# EAGLE schematic zed_io_board (EAGLE 6.5.0)
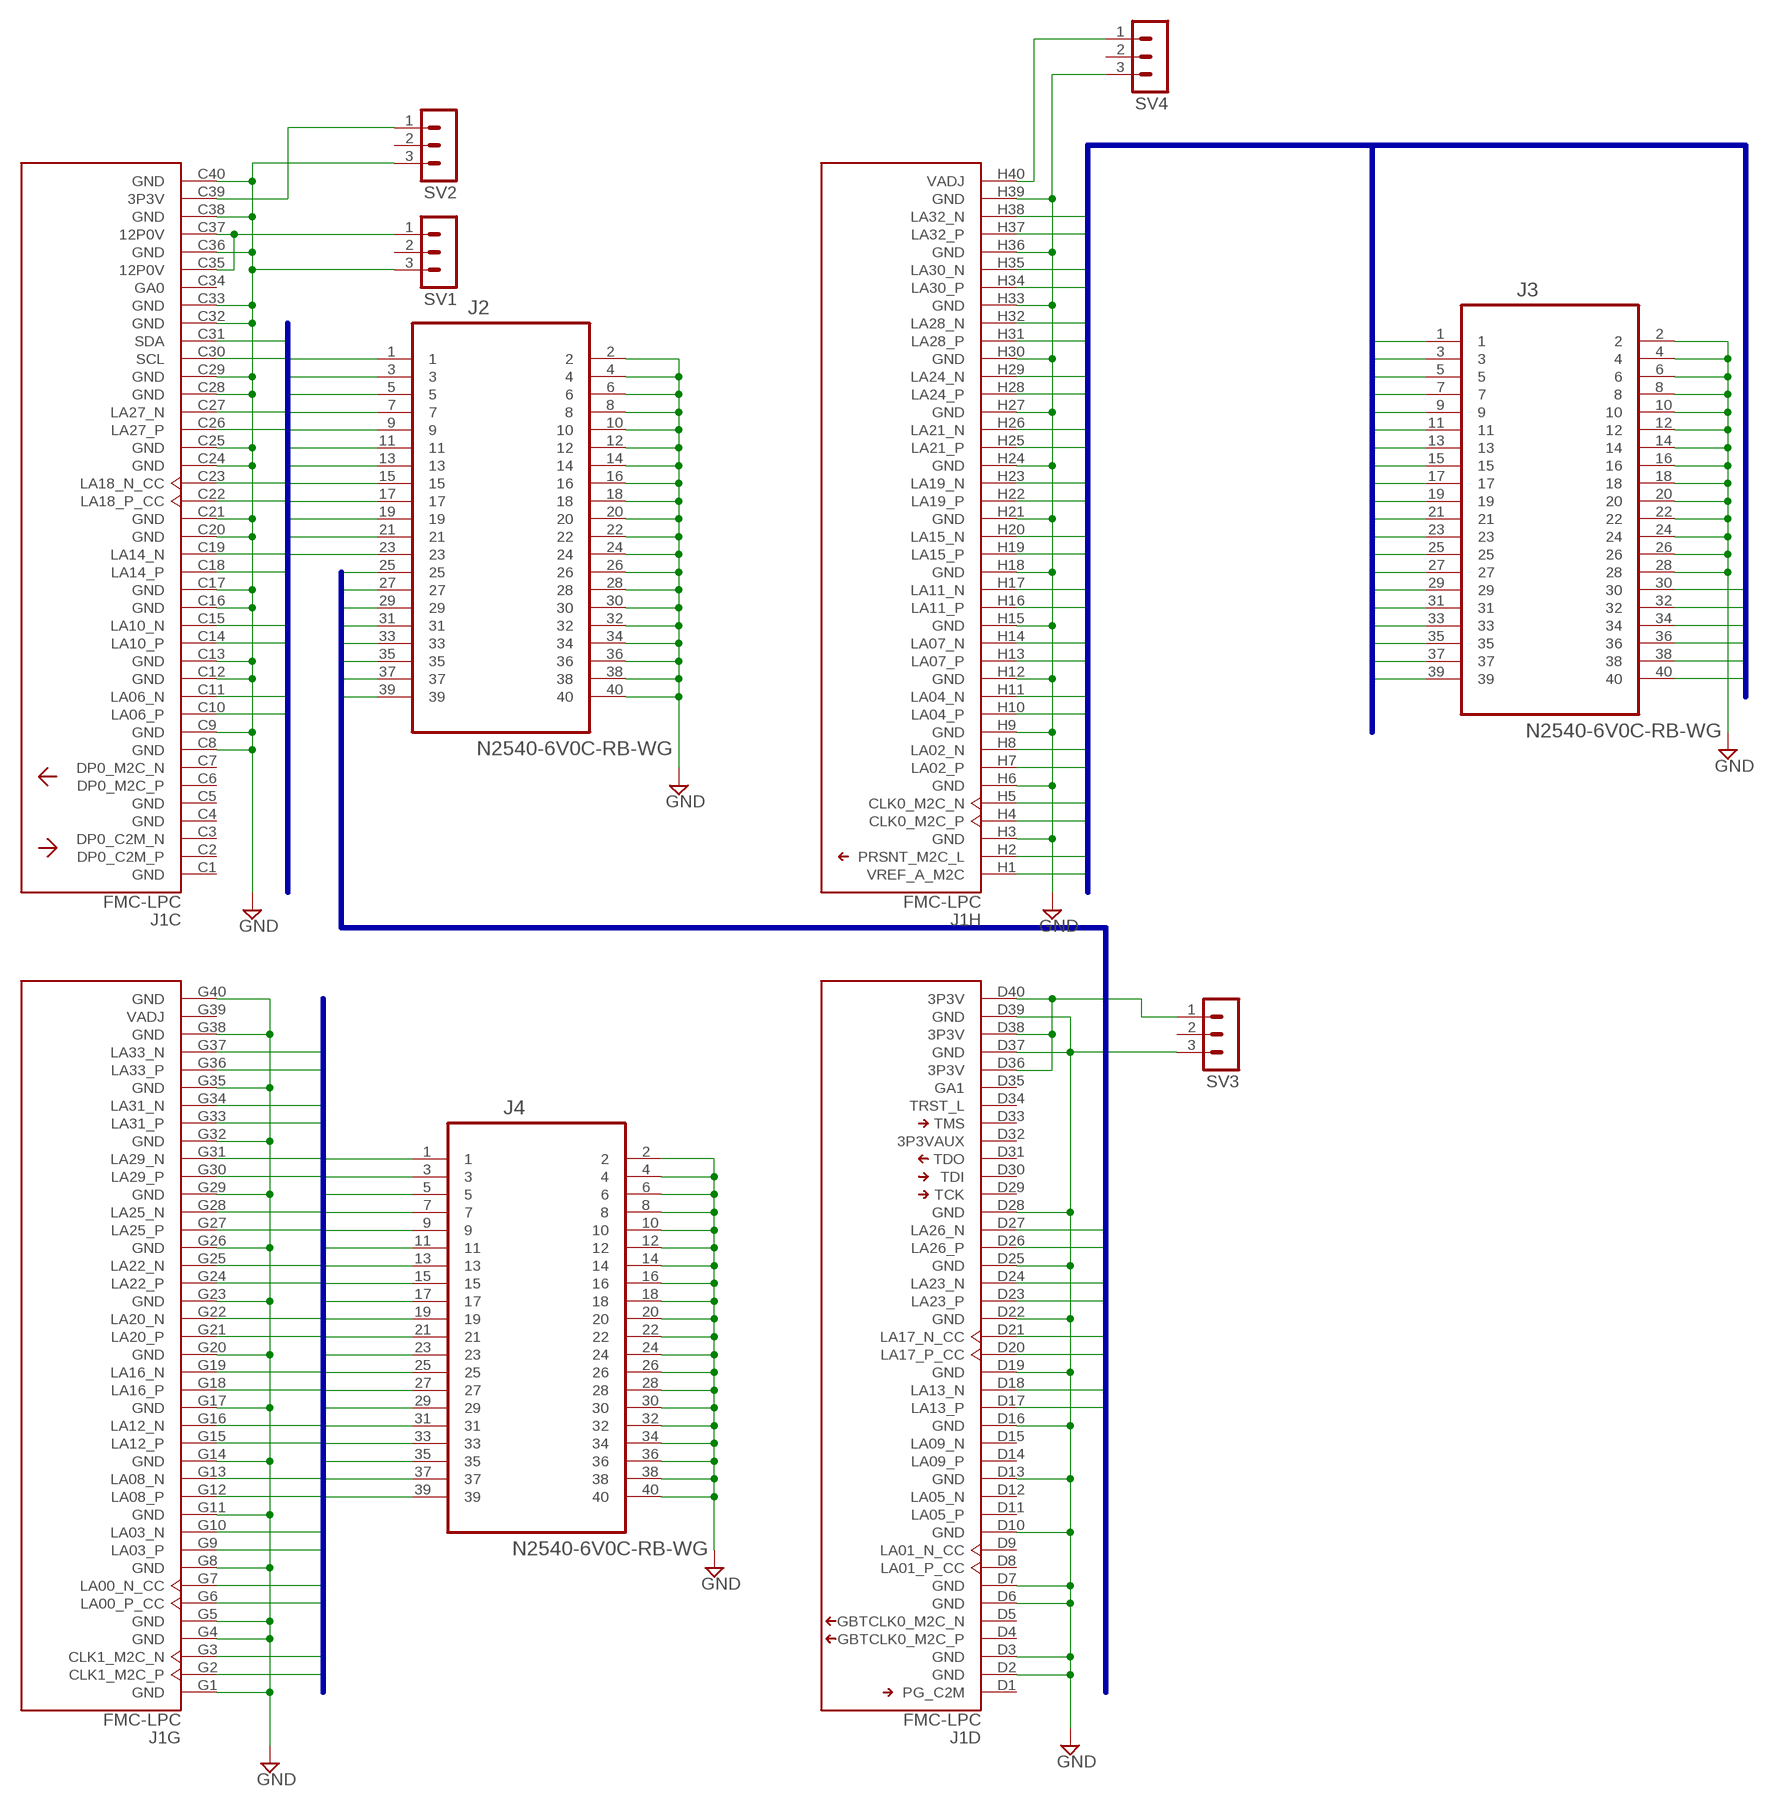
[diagram p0: schematic, sheet 1]

## Parts
J1  FMC-LPC  [FMC-LPC-MALE]
J2  N2540-6V0C-RB-WG  [N2540-6V0C-RB-WG]
J3  N2540-6V0C-RB-WG  [N2540-6V0C-RB-WG]
J4  N2540-6V0C-RB-WG  [N2540-6V0C-RB-WG]
SV1  MA03-1  [MA03-1]
SV2  MA03-1  [MA03-1]
SV3  MA03-1  [MA03-1]
SV4  MA03-1  [MA03-1]

## Nets
BA1: J1.H38(H:LA32_N) J3.1
BA2: J1.H37(H:LA32_P) J3.3
BA3: J1.H35(H:LA30_N) J3.5
BA4: J1.H34(H:LA30_P) J3.7
BA5: J1.H32(H:LA28_N) J3.9
BA6: J1.H31(H:LA28_P) J3.11
BA7: J1.H29(H:LA24_N) J3.13
BA8: J1.H28(H:LA24_P) J3.15
BA9: J1.H26(H:LA21_N) J3.17
BA10: J1.H25(H:LA21_P) J3.19
BA11: J1.H23(H:LA19_N) J3.21
BA12: J1.H22(H:LA19_P) J3.23
BA13: J1.H20(H:LA15_N) J3.25
BA14: J1.H19(H:LA15_P) J3.27
BA15: J1.H17(H:LA11_N) J3.29
BA16: J1.H16(H:LA11_P) J3.31
BA17: J1.H14(H:LA07_N) J3.33
BA18: J1.H13(H:LA07_P) J3.35
BA19: J1.H11(H:LA04_N) J3.37
BA20: J1.H10(H:LA04_P) J3.39
BA21: J1.H8(H:LA02_N) J3.30
BA22: J1.H7(H:LA02_P) J3.32
BA23: J1.H5(H:CLK0_M2C_N) J3.34
BA24: J1.H4(H:CLK0_M2C_P) J3.36
BA25: J1.H2(H:PRSNT_M2C_L) J3.38
BA26: J1.H1(H:VREF_A_M2C) J3.40
BB1: J1.C31(C:SDA) J2.1
BB2: J1.C30(C:SCL) J2.3
BB3: J1.C27(C:LA27_N) J2.5
BB4: J1.C26(C:LA27_P) J2.7
BB5: J1.C23(C:LA18_N_CC) J2.9
BB6: J1.C22(C:LA18_P_CC) J2.11
BB7: J1.C19(C:LA14_N) J2.13
BB8: J1.C18(C:LA14_P) J2.15
BB9: J1.C15(C:LA10_N) J2.17
BB10: J1.C14(C:LA10_P) J2.19
BB11: J1.C11(C:LA06_N) J2.21
BB12: J1.C10(C:LA06_P) J2.23
BD1: J1.D27(D:LA26_N) J2.25
BD2: J1.D26(D:LA26_P) J2.27
BD3: J1.D24(D:LA23_N) J2.29
BD4: J1.D23(D:LA23_P) J2.31
BD5: J1.D21(D:LA17_N_CC) J2.33
BD6: J1.D20(D:LA17_P_CC) J2.35
BD7: J1.D18(D:LA13_N) J2.37
BD8: J1.D17(D:LA13_P) J2.39
BG1: J1.G37(G:LA33_N) J4.1
BG2: J1.G36(G:LA33_P) J4.3
BG3: J1.G34(G:LA31_N) J4.5
BG4: J1.G33(G:LA31_P) J4.7
BG5: J1.G31(G:LA29_N) J4.9
BG6: J1.G30(G:LA29_P) J4.11
BG7: J1.G28(G:LA25_N) J4.13
BG8: J1.G27(G:LA25_P) J4.15
BG9: J1.G25(G:LA22_N) J4.17
BG10: J1.G24(G:LA22_P) J4.19
BG11: J1.G22(G:LA20_N) J4.21
BG12: J1.G21(G:LA20_P) J4.23
BG13: J1.G19(G:LA16_N) J4.25
BG14: J1.G18(G:LA16_P) J4.27
BG15: J1.G16(G:LA12_N) J4.29
BG16: J1.G15(G:LA12_P) J4.31
BG17: J1.G13(G:LA08_N) J4.33
BG18: J1.G12(G:LA08_P) J4.35
BG19: J1.G10(G:LA03_N) J4.37
BG20: J1.G9(G:LA03_P) J4.39
BG21: J1.G7(G:LA00_N_CC)
BG22: J1.G6(G:LA00_P_CC)
BG23: J1.G3(G:CLK1_M2C_N)
BG24: J1.G2(G:CLK1_M2C_P)
GND: J1.C8(C:GND) J1.C9(C:GND) J1.C12(C:GND) J1.C13(C:GND) J1.C16(C:GND) J1.C17(C:GND) J1.C20(C:GND) J1.C21(C:GND) J1.C24(C:GND) J1.C25(C:GND) J1.C28(C:GND) J1.C29(C:GND) J1.C32(C:GND) J1.C33(C:GND) J1.C36(C:GND) J1.C38(C:GND) J1.C40(C:GND) J1.D2(D:GND) J1.D3(D:GND) J1.D6(D:GND) J1.D7(D:GND) J1.D10(D:GND) J1.D13(D:GND) J1.D16(D:GND) J1.D19(D:GND) J1.D22(D:GND) J1.D25(D:GND) J1.D28(D:GND) J1.D37(D:GND) J1.D39(D:GND) J1.G1(G:GND) J1.G4(G:GND) J1.G5(G:GND) J1.G8(G:GND) J1.G11(G:GND) J1.G14(G:GND) J1.G17(G:GND) J1.G20(G:GND) J1.G23(G:GND) J1.G26(G:GND) J1.G29(G:GND) J1.G32(G:GND) J1.G35(G:GND) J1.G38(G:GND) J1.G40(G:GND) J1.H3(H:GND) J1.H6(H:GND) J1.H9(H:GND) J1.H12(H:GND) J1.H15(H:GND) J1.H18(H:GND) J1.H21(H:GND) J1.H24(H:GND) J1.H27(H:GND) J1.H30(H:GND) J1.H33(H:GND) J1.H36(H:GND) J1.H39(H:GND) J2.2 J2.4 J2.6 J2.8 J2.10 J2.12 J2.14 J2.16 J2.18 J2.20 J2.22 J2.24 J2.26 J2.28 J2.30 J2.32 J2.34 J2.36 J2.38 J2.40 J3.2 J3.4 J3.6 J3.8 J3.10 J3.12 J3.14 J3.16 J3.18 J3.20 J3.22 J3.24 J3.26 J3.28 J4.2 J4.4 J4.6 J4.8 J4.10 J4.12 J4.14 J4.16 J4.18 J4.20 J4.22 J4.24 J4.26 J4.28 J4.30 J4.32 J4.34 J4.36 J4.38 J4.40 SV1.3 SV2.3 SV3.3 SV4.3
N$1: J1.C39(C:3P3V) SV2.1
N$2: J1.C35(C:12P0V) J1.C37(C:12P0V) SV1.1
N$3: J1.H40(H:VADJ) SV4.1
N$4: J1.D36(D:3P3V) J1.D38(D:3P3V) J1.D40(D:3P3V) SV3.1
Unconnected: J1.C1(C:GND) J1.C2(C:DP0_C2M_P) J1.C3(C:DP0_C2M_N) J1.C4(C:GND) J1.C5(C:GND) J1.C6(C:DP0_M2C_P) J1.C7(C:DP0_M2C_N) J1.C34(C:GA0) J1.D1(D:PG_C2M) J1.D4(D:GBTCLK0_M2C_P) J1.D5(D:GBTCLK0_M2C_N) J1.D8(D:LA01_P_CC) J1.D9(D:LA01_N_CC) J1.D11(D:LA05_P) J1.D12(D:LA05_N) J1.D14(D:LA09_P) J1.D15(D:LA09_N) J1.D29(D:TCK) J1.D30(D:TDI) J1.D31(D:TDO) J1.D32(D:3P3VAUX) J1.D33(D:TMS) J1.D34(D:TRST_L) J1.D35(D:GA1) J1.G39(G:VADJ) SV1.2 SV2.2 SV3.2 SV4.2

## Buses
BA[1..28]
BB[1..12]
BG[1..24]
BD[1..8]

## Library data of the parts
J1 = dan-xilinx:FMC-LPC: FMC-LPC Bottom side connector for interfacing with Xilinx FPGA development boards (e.g. SP605); OC_NEWARK: unknown
J2-J4 = NicksParts:N2540-6V0C-RB-WG
SV1-SV4 = con-lstb:MA03-1: PIN HEADER; OC_FARNELL: unknown; OC_NEWARK: unknown